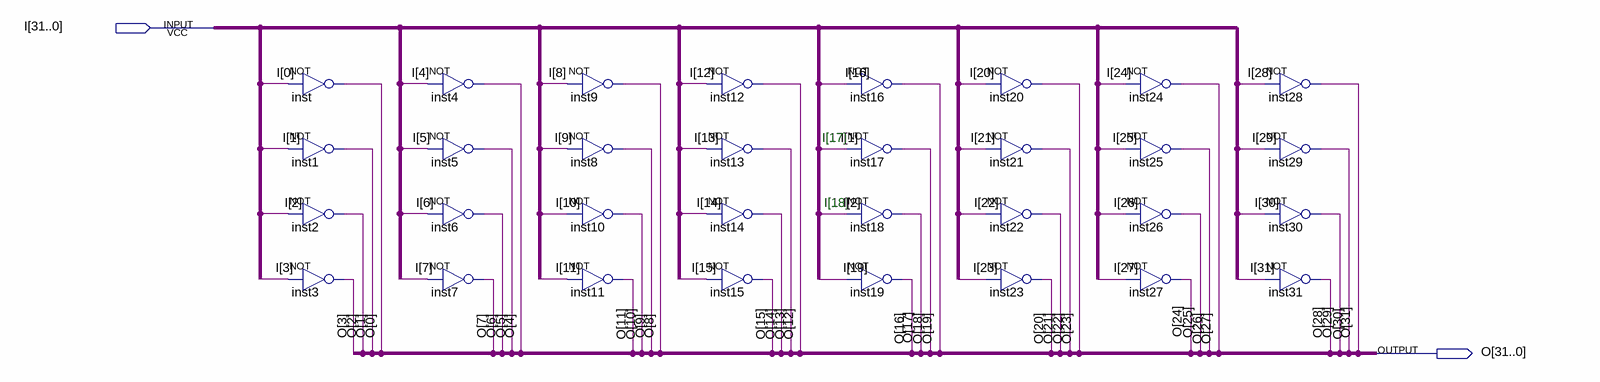
[diagram p0: schematic sheet]
// Quartus schematic not32.bdf as structural Verilog: 32 symbols, 2 pins
module not32 (
  input  [31:0] I,
  output [31:0] O
);

  not inst (O[0], I[0]);
  not inst1 (O[1], I[1]);
  not inst2 (O[2], I[2]);
  not inst3 (O[3], I[3]);
  not inst4 (O[4], I[4]);
  not inst5 (O[5], I[5]);
  not inst6 (O[6], I[6]);
  not inst7 (O[7], I[7]);
  not inst9 (O[8], I[8]);
  not inst8 (O[9], I[9]);
  not inst10 (O[10], I[10]);
  not inst11 (O[11], I[11]);
  not inst12 (O[12], I[12]);
  not inst13 (O[13], I[13]);
  not inst14 (O[14], I[14]);
  not inst15 (O[15], I[15]);
  not inst16 (O[19], I[16]);
  not inst17 (O[18], I[1]);
  not inst18 (O[17], I[2]);
  not inst19 (O[16], I[19]);
  not inst20 (O[23], I[20]);
  not inst21 (O[22], I[21]);
  not inst22 (O[21], I[22]);
  not inst23 (O[20], I[23]);
  not inst24 (O[27], I[24]);
  not inst25 (O[26], I[25]);
  not inst26 (O[25], I[26]);
  not inst27 (O[24], I[27]);
  not inst28 (O[31], I[28]);
  not inst29 (O[30], I[29]);
  not inst30 (O[29], I[30]);
  not inst31 (O[28], I[31]);

  // Notes on the sheet:
  //   I[17]
  //   I[18]
endmodule
